# EAGLE schematic UsbParMarkerV3 v14 (EAGLE 9.7.0)
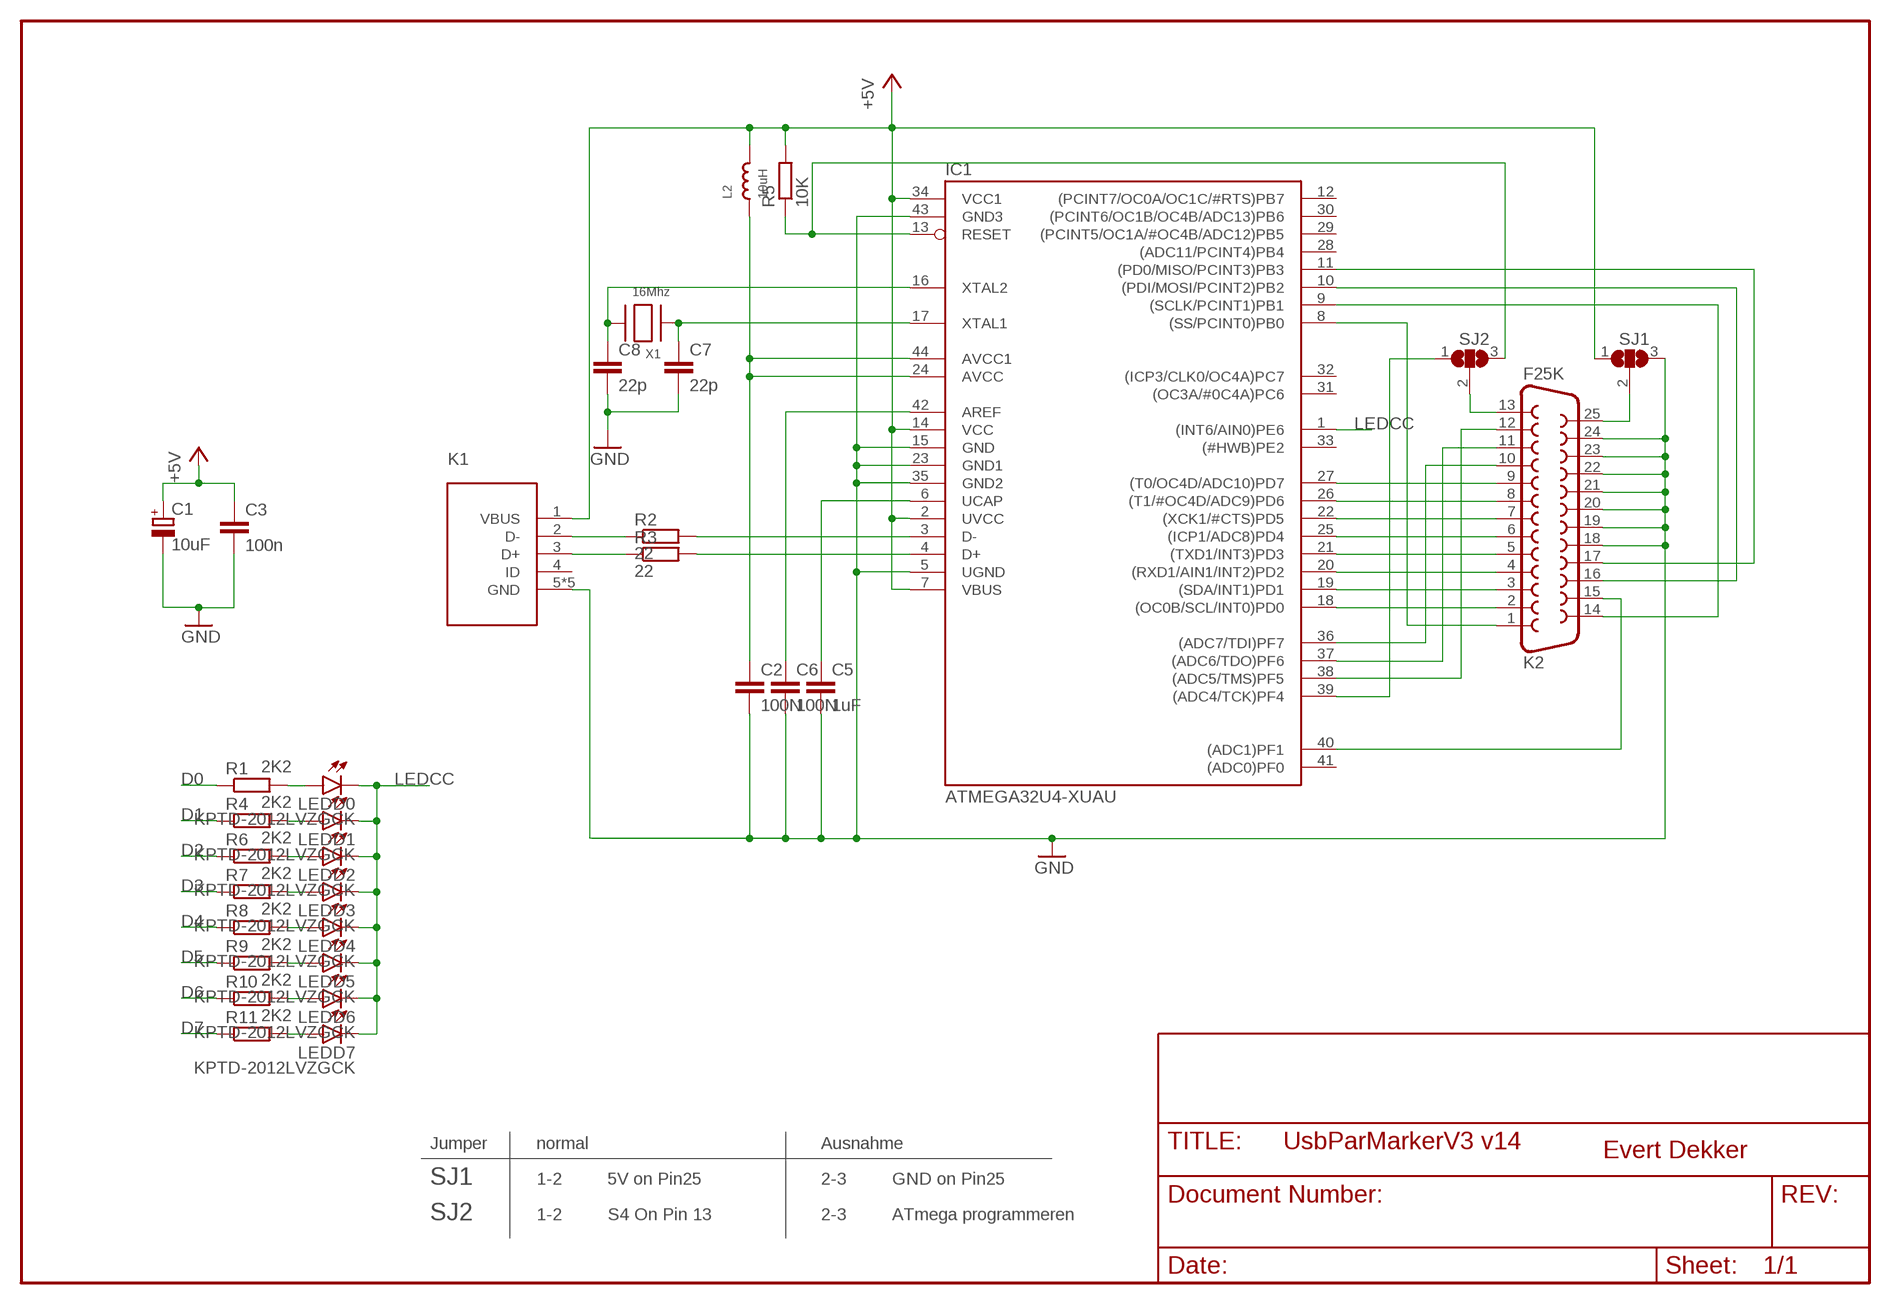
[diagram p0: schematic, sheet 1]

## Parts
C1  10uF  CPOL-EUR/2012-12R  [R/2012-12R]
C2  100N  C-EUC0805  [C0805]
C3  100n  C-EUC0805  [C0805]
C5  1uF  C-EUC0805  [C0805]
C6  100N  C-EUC0805  [C0805]
C7  22p  C-EUC0805  [C0805]
C8  22p  C-EUC0805  [C0805]
IC1  ATMEGA32U4-XUAU  [TQFP44-PAD]
K1  USBMINIB  [MINIUSB]
K2  F25K  [F25K]
L2  10uH  INDUCTOR0805  [0805]
LEDD0  KPTD-2012LVZGCK  LED  [CHIP-LED0805]
LEDD1  KPTD-2012LVZGCK  LED  [CHIP-LED0805]
LEDD2  KPTD-2012LVZGCK  LED  [CHIP-LED0805]
LEDD3  KPTD-2012LVZGCK  LED  [CHIP-LED0805]
LEDD4  KPTD-2012LVZGCK  LED  [CHIP-LED0805]
LEDD5  KPTD-2012LVZGCK  LED  [CHIP-LED0805]
LEDD6  KPTD-2012LVZGCK  LED  [CHIP-LED0805]
LEDD7  KPTD-2012LVZGCK  LED  [CHIP-LED0805]
R1  2K2  R-EU_R0603  [R0603]
R2  22  R-EU_R0603  [R0603]
R3  22  R-EU_R0603  [R0603]
R4  2K2  R-EU_R0603  [R0603]
R5  10K  R-EU_R0603  [R0603]
R6  2K2  R-EU_R0603  [R0603]
R7  2K2  R-EU_R0603  [R0603]
R8  2K2  R-EU_R0603  [R0603]
R9  2K2  R-EU_R0603  [R0603]
R10  2K2  R-EU_R0603  [R0603]
R11  2K2  R-EU_R0603  [R0603]
SJ1  SJ3P  [SJ3P]
SJ2  SJ3P  [SJ3P]
X1  16Mhz  XTALNX5032  [NX5032]

## Nets
+5V [Vcc]: C1.+ C3.2 IC1.2(UVCC) IC1.7(VBUS) IC1.14(VCC) IC1.34(VCC1) K1.1(VBUS) L2.2 R5.2 SJ1.1
D0: IC1.18((OC0B/SCL/INT0)PD0) K2.2 R1.1
D1: IC1.19((SDA/INT1)PD1) K2.3 R4.1
D2: IC1.20((RXD1/AIN1/INT2)PD2) K2.4 R6.1
D3: IC1.21((TXD1/INT3)PD3) K2.5 R7.1
D4: IC1.25((ICP1/ADC8)PD4) K2.6 R8.1
D5: IC1.22((XCK1/#CTS)PD5) K2.7 R9.1
D6: IC1.26((T1/#OC4D/ADC9)PD6) K2.8 R10.1
D7: IC1.27((T0/OC4D/ADC10)PD7) K2.9 R11.1
GND: C1.- C2.2 C3.1 C5.2 C6.2 C7.2 C8.2 IC1.5(UGND) IC1.15(GND) IC1.23(GND1) IC1.35(GND2) IC1.43(GND3) K1.5(GND) K1.11(GND) K1.12(GND) K1.13(GND) K1.14(GND) K2.18 K2.19 K2.20 K2.21 K2.22 K2.23 K2.24 SJ1.3
LEDCC: IC1.1((INT6/AIN0)PE6) LEDD0.C LEDD1.C LEDD2.C LEDD3.C LEDD4.C LEDD5.C LEDD6.C LEDD7.C
N$1: K1.2(D-) R2.1
N$2: K1.3(D+) R3.1
N$3: K2.13 SJ2.2
N$4: IC1.36((ADC7/TDI)PF7) K2.10
N$6: C2.1 IC1.24(AVCC) IC1.44(AVCC1) L2.1
N$7: LEDD0.A R1.2
N$8: LEDD1.A R4.2
N$16: IC1.8((SS/PCINT0)PB0) K2.1
N$17: IC1.39((ADC4/TCK)PF4) SJ2.1
N$18: IC1.38((ADC5/TMS)PF5) K2.12
N$19: IC1.37((ADC6/TDO)PF6) K2.11
N$20: LEDD2.A R6.2
N$21: IC1.9((SCLK/PCINT1)PB1) K2.14
N$22: IC1.10((PDI/MOSI/PCINT2)PB2) K2.16
N$23: IC1.11((PD0/MISO/PCINT3)PB3) K2.17
N$24: IC1.40((ADC1)PF1) K2.15
N$25: K2.25 SJ1.2
N$26: LEDD3.A R7.2
N$27: LEDD4.A R8.2
N$28: LEDD5.A R9.2
N$29: LEDD6.A R10.2
N$30: LEDD7.A R11.2
N$44: IC1.3(D-) R2.2
N$46: IC1.4(D+) R3.2
N$48: C6.1 IC1.42(AREF)
N$49: C8.1 IC1.16(XTAL2) X1.P$2
N$50: C5.1 IC1.6(UCAP)
N$51: C7.1 IC1.17(XTAL1) X1.P$1
RESET: IC1.13(RESET) R5.1 SJ2.3
Unconnected: IC1.12((PCINT7/OC0A/OC1C/#RTS)PB7) IC1.28((ADC11/PCINT4)PB4) IC1.29((PCINT5/OC1A/#OC4B/ADC12)PB5) IC1.30((PCINT6/OC1B/OC4B/ADC13)PB6) IC1.31((OC3A/#0C4A)PC6) IC1.32((ICP3/CLK0/OC4A)PC7) IC1.33((#HWB)PE2) IC1.41((ADC0)PF0) K1.4(ID)

## Notes on the sheet
- Jumper | normal | Ausnahme
- Evert Dekker
- SJ1 | 1-2 | 5V on Pin25 | 2-3 | GND on Pin25
- SJ2 | 1-2 | S4 On Pin 13 | 2-3 | ATmega programmeren

## Library data of the parts
C1 = rcl:CPOL-EU: POLARIZED CAPACITOR, European symbol; SPICEPREFIX: C
C2 C3 C5 C6 = rcl:C-EU: CAPACITOR, European symbol; SPICEPREFIX: C
C7 C8 = rcl:C-EU: CAPACITOR, European symbol; FARNELL: 1759489; SPICEPREFIX: C
IC1 = SmartPrj:ATMEGA32U4-XU; RS: 715-3805
K1 = Mini_usb:USBMINIB; LCSC: SOFNG CZ-519
K2 = hs-ul:F25: SubD-Buchse korrigiert und verschönert Kantenmontage Reichelt D-SUB BU 25 0,14€
L2 = microbuilder:INDUCTOR: Inductors 0603: 10nH Ceramic Inductor - microwire antenna/RF (Digikey: 712-1434-2-ND) 0805: 560nH Ceramic Inductor - RF (Digikey: 553-1047-1-ND) 270nH Ceramic Inductor - Q = 40@250MHz, +-5%, 1 Ohm DC Resistance (Digikey: 535-10506-2-ND) 1007 (2518 Metric) SMT: 10µH 10% 250mOhm 820mA 1007 Inductor (Digikey: 587-2189-1-ND) 22µH 10% 500mOhm 580mA 1007 Inductor (Digikey: 587-2190-1-ND) 47µH 10% 950mOhm 420mA 1007 Inductor (Digikey: 587-2191-1-ND) 47µH 5% 100mOhm 1A 1008 Inductor (Digikey: 732-1816-1-ND) 5.0x5.0mm (Taiyo Yuden NR5040 Series) 6.8µH 20% 2.3A 64mOhm Inductor (Digikey: 587-2374-2-ND) 5.0x5.0mm (TDK VLC5045 Series) 4.7µH 20% 3.3A 34mOhm Inductor (Digikey: 445-6526-1-ND) 6.8µH 20% 2.7A 46mOhm Inductor (Digikey: 445-6527-1-ND) 6.0x6.0mm (TDK VLC6045 Series) 4.7µH 20% 3.8A 27mOhm Inductor (Digikey: 445-6538-2-ND) 6.8µH 20% 3A 41mOhm Inductor (Digikey: 445-6540-1-ND) 6.2µH 30% 2.2A 45mOhm Inductor (Digikey: SRR5028-6R2YCT-ND) - Not TDK VLC6045 but footprint should match 6.0x6.0mm (TDK SLF6045 Series) 6.8uH 30% 2A 33mOhm Inductor (Digikey: 445-4572-1-ND, Mouser: 810-SLF645T6R8N2R0PF); FARNELL: 2215650
LEDD0 LEDD1-LEDD7 = LedKingbright:LED; FARNELL: 2846598
R1-R11 = rcl:R-EU_: RESISTOR, European symbol; SPICEPREFIX: R
SJ1 SJ2 = hs-ul:SJ3P: Lötbrücke 3pol. Spaltbreite 0,15 mm
X1 = adafruit:XTAL: Low cost SMT crystals, no capacitors included http://www.ladyada.net/library/eagle; FARNELL: 2467791

## Net classes
0 default: width 0.203 mm
1 RowCols: width 0.356 mm, clearance 0.203 mm
2 Vcc: width 0.305 mm, clearance 0.203 mm